# Altium project OctopusPB_r0102.PrjPcb (part 2 of 2)

## Sheet Power+USB.SchDoc
size A3
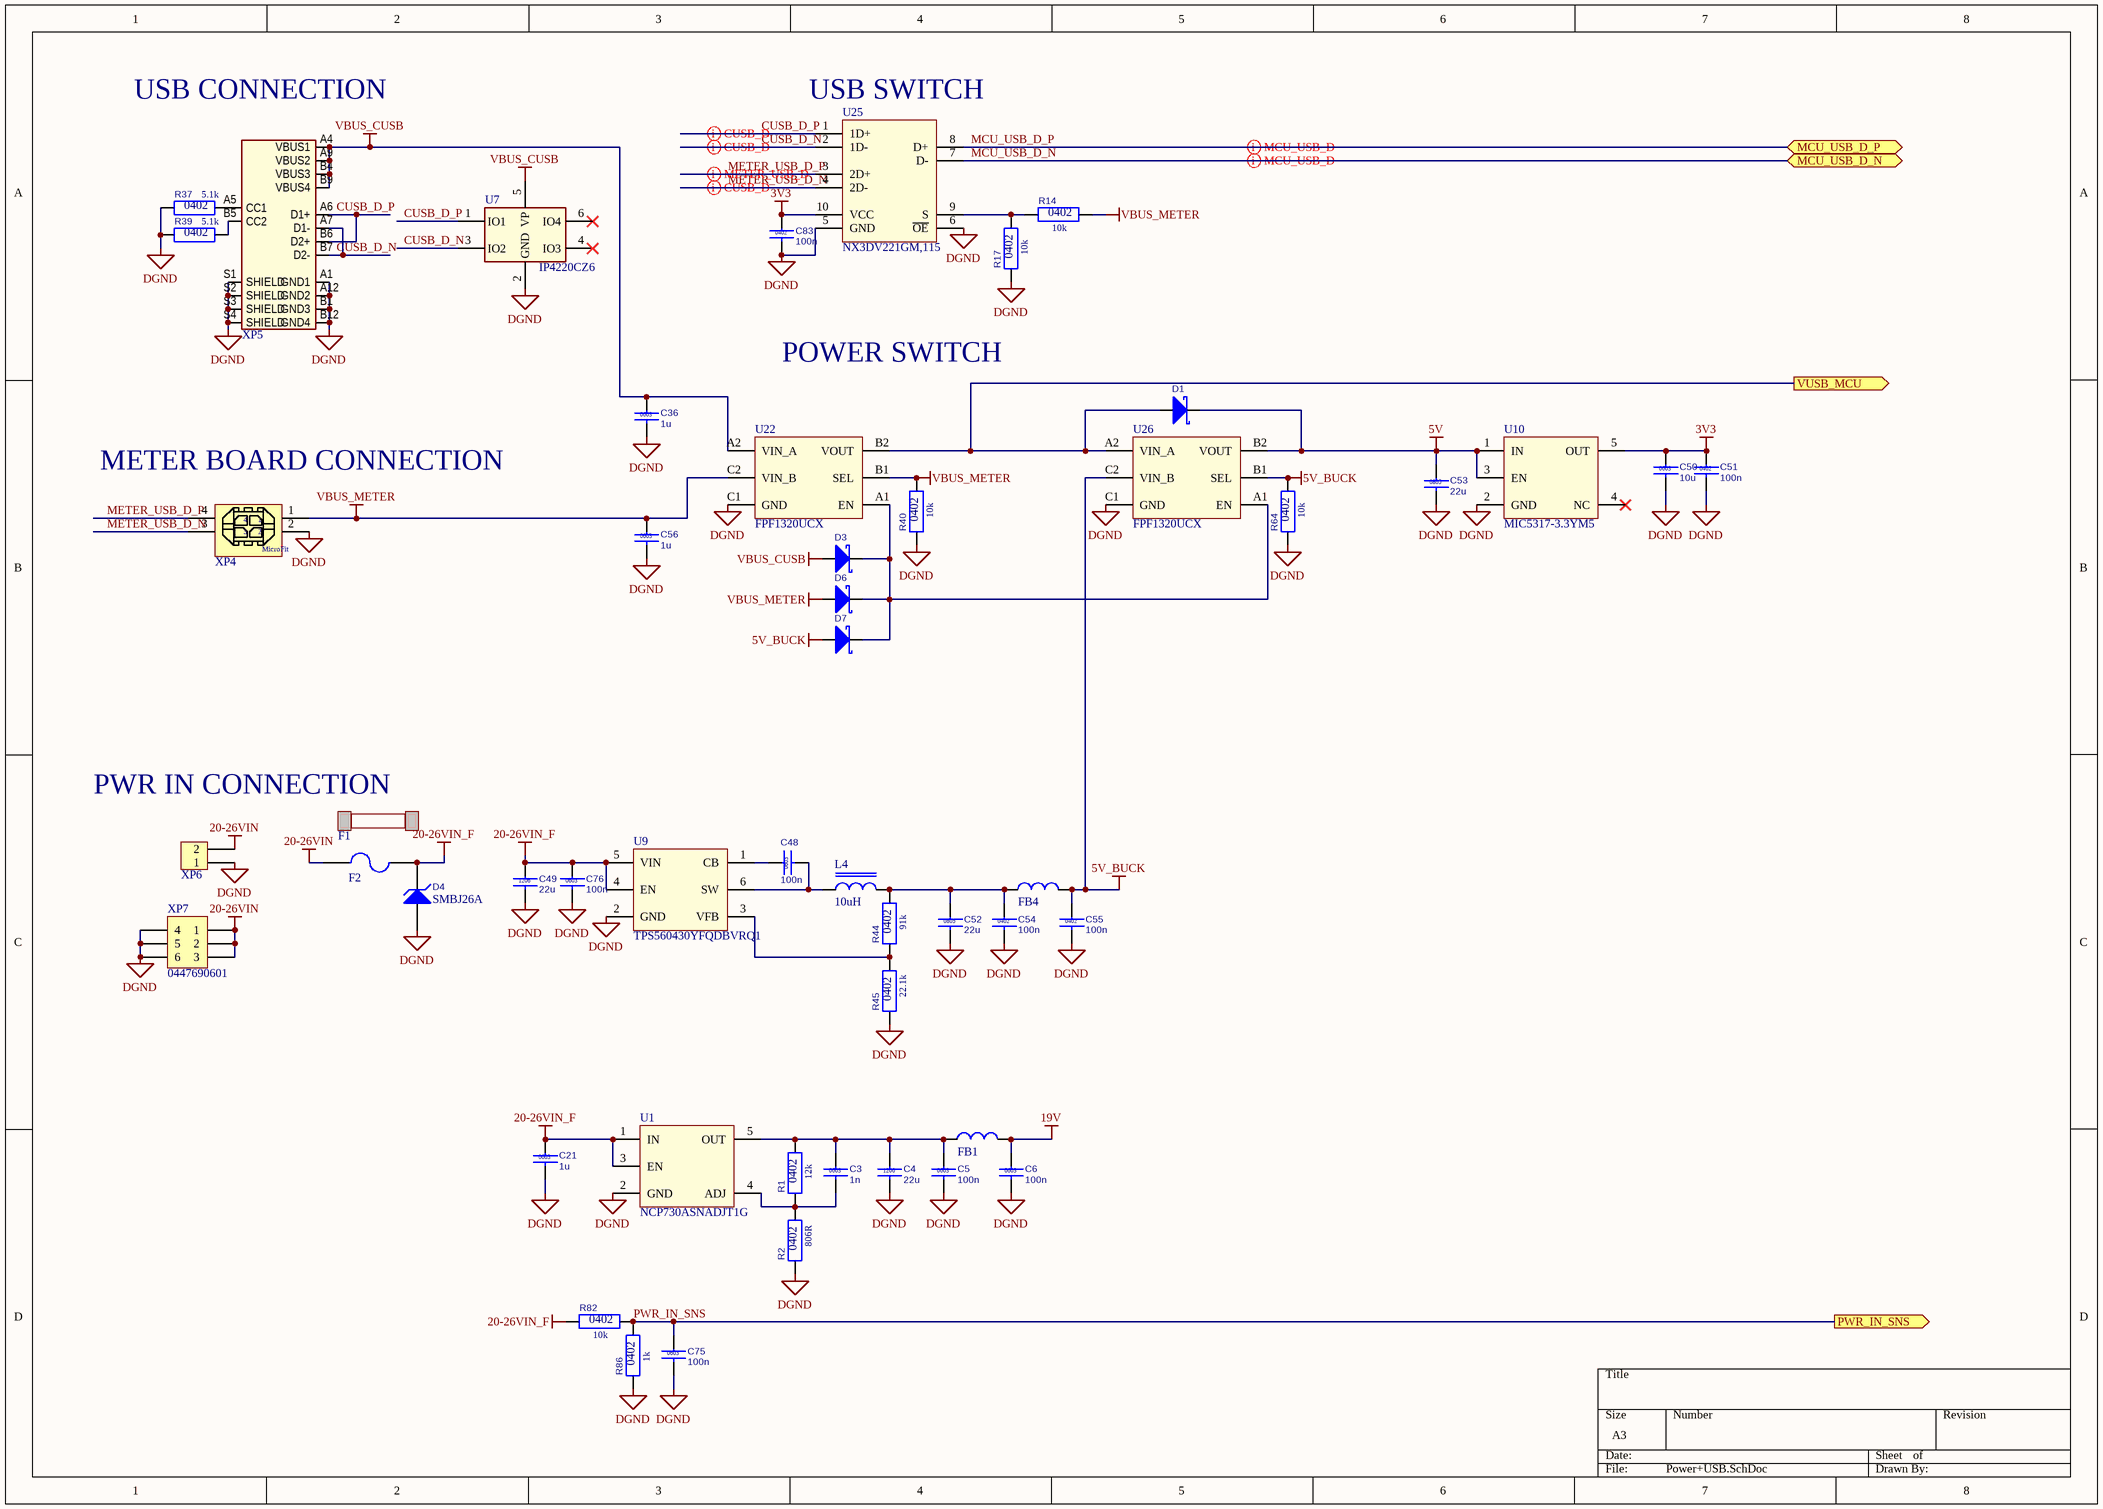
[diagram p5: Power+USB.SchDoc]

### Parts
C3  1n  Case: 0603  [CC0603M]
C4  22u  Case: 1206  [CC1206M]
C5  100n  Case: 0603  [CC0603M]
C6  100n  Case: 0603  [CC0603M]
C21  1u  Case: 0603  [CC0603M]
C36  1u  Case: 0603  [CC0603M]
C48  100n  Case: 0603  [CC0603M]
C49  22u  Case: 1206  [CC1206M]
C50  10u  Case: 0603  [CC0603M]
C51  100n  Case: 0402  [CC0402M]
C52  22u  Case: 0805  [CC0805M]
C53  22u  Case: 0805  [CC0805M]
C54  100n  Case: 0402  [CC0402M]
C55  100n  Case: 0402  [CC0402M]
C56  1u  Case: 0603  [CC0603M]
C75  100n  Case: 0603  [CC0603M]
C76  100n  Case: 0603  [CC0603M]
C83  100n  Case: 0402  [CC0402M]
D1  BAT54HT1G  [SOD323]  (value not drawn)
D3  BAT54HT1G  [SOD323]  (value not drawn)
D4  SMBJ26A  [SMB_UNI]
D6  BAT54HT1G  [SOD323]  (value not drawn)
D7  BAT54HT1G  [SOD323]  (value not drawn)
F1  0217015.MXP  (value not drawn)
F2  696108003002  [696108003002]  (value not drawn)
FB1  BLM18HG102SN1D  [FB0603M]  (value not drawn)
FB4  BLM21SP601SH1D  [FB0805M]  (value not drawn)
L4  10uH  [0518CDMCCDS]
R1  Case: 0402  [RC0402M]  (hidden comment: 12k)
R2  Case: 0402  [RC0402M]  (hidden comment: 806R)
R14  Case: 0402  [RC0402M]  (hidden comment: 10k)
R17  Case: 0402  [RC0402M]  (hidden comment: 10k)
R37  Case: 0402  [RC0402M]  (hidden comment: 5.1k)
R39  Case: 0402  [RC0402M]  (hidden comment: 5.1k)
R40  Case: 0402  [RC0402M]  (hidden comment: 10k)
R44  Case: 0402  [RC0402M]  (hidden comment: 91k)
R45  Case: 0402  [RC0402M]  (hidden comment: 22.1k)
R64  Case: 0402  [RC0402M]  (hidden comment: 10k)
R82  Case: 0402  [RC0402M]  (hidden comment: 10k)
R86  Case: 0402  [RC0402M]  (hidden comment: 1k)
U1  NCP730ASNADJT1G  [TSOP-5]
U7  IP4220CZ6  [TSOP-6]
U9  TPS560430YFQDBVRQ1  [SOT23-6]
U10  MIC5317-3.3YM5  [SOT23-5]
U22  FPF1320UCX  [WLCSP-6]
U25  NX3DV221GM,115  [XQFN-10(SOT1049-3)]
U26  FPF1320UCX  [WLCSP-6]
XP4  0447690401  [0447690401]  (value not drawn)
XP5  KUSBX-SL-CS1N14-B  [KUSBX-SL-CS1N14-B]  (value not drawn)
XP6  TBH-2x5.08P-RA-GN  [TBH-2x5.08P-RA-GN]  (value not drawn)
XP7  0447690601  [0447690601]

### Ports
MCU_USB_D_N (bidir), MCU_USB_D_P (bidir), PWR_IN_SNS (out), VUSB_MCU (out)

### Nets
3V3: C50.1 C51.1 C83.1 U10.5(OUT) U25.10(VCC)
5V: C53.1 D1.1(K) U10.1(IN) U10.3(EN) U26.B2(VOUT)
5V_BUCK: C55.1 D7.2(A) FB4.2 R64.2 U26.B1(SEL) U26.C2(VIN_B)
19V: C6.1 FB1.2
20-26VIN: F2.1 XP6.2 XP7.1 XP7.2 XP7.3
20-26VIN_F: C21.1 C49.1 C76.1 D4.1(K) F2.2 R82.1 U1.1(IN) U1.3(EN) U9.4(EN) U9.5(VIN)
DGND: C4.2 C5.2 C6.2 C21.2 C36.2 C49.2 C50.2 C51.2 C52.2 C53.2 C54.2 C55.2 C56.2 C75.2 C76.2 C83.2 D4.2(A) R2.1 R17.1 R37.1 R39.1 R40.1 R45.1 R64.1 R86.1 U1.2(GND) U7.2(GND) U9.2(GND) U10.2(GND) U22.C1(GND) U25.5(GND) U25.6(~{OE}) U26.C1(GND) XP4.2 XP5.A1(GND1) XP5.A12(GND2) XP5.B1(GND3) XP5.B12(GND4) XP5.S1(SHIELD) XP5.S2(SHIELD) XP5.S3(SHIELD) XP5.S4(SHIELD) XP6.1 XP7.4 XP7.5 XP7.6
VBUS_CUSB: C36.1 D3.2(A) U7.5(VP) U22.A2(VIN_A) XP5.A4(VBUS1) XP5.A9(VBUS2) XP5.B4(VBUS3) XP5.B9(VBUS4)
VBUS_METER: C56.1 D6.2(A) R14.2 R40.2 U22.B1(SEL) U22.C2(VIN_B) XP4.1
CUSB_D_N: U7.3(IO2) U25.2(1D-) XP5.A7(D1-) XP5.B7(D2-)
CUSB_D_P: U7.1(IO1) U25.1(1D+) XP5.A6(D1+) XP5.B6(D2+)
MCU_USB_D_N: U25.7(D-) ; port MCU_USB_D_N
MCU_USB_D_P: U25.8(D+) ; port MCU_USB_D_P
METER_USB_D_N: U25.4(2D-) XP4.3
METER_USB_D_P: U25.3(2D+) XP4.4
PWR_IN_SNS: C75.1 R82.2 R86.2 ; port PWR_IN_SNS
VUSB_MCU: D1.2(A) U22.B2(VOUT) U26.A2(VIN_A) ; port VUSB_MCU
NetC3_1: C3.1 C4.1 C5.1 FB1.1 R1.2 U1.5(OUT)
NetC3_2: C3.2 R1.1 R2.2 U1.4(ADJ)
NetC48_1: C48.1 U9.1(CB)
NetC48_2: C48.2 L4.1 U9.6(SW)
NetC52_1: C52.1 C54.1 FB4.1 L4.2 R44.2
NetD3_1: D3.1(K) D6.1(K) D7.1(K) U22.A1(EN) U26.A1(EN)
NetR14_1: R14.1 R17.2 U25.9(S)
NetR37_2: R37.2 XP5.A5(CC1)
NetR39_2: R39.2 XP5.B5(CC2)
NetR44_1: R44.1 R45.2 U9.3(VFB)

Not connected (* = marked no-connect by the designer): U7 4(IO3)* 6(IO4)*; U10 4(NC)*

### Layout directives
differential pair: CUSB_D_N, CUSB_D_P, MCU_USB_D_N, MCU_USB_D_P, METER_USB_D_N, METER_USB_D_P

### Notes on the sheet
- (near XP5) USB CONNECTION
- (near U25) USB SWITCH
- POWER SWITCH
- (near XP4) METER BOARD CONNECTION
- (near F1) PWR IN CONNECTION
- (in symbol 0447690401) MicroFit

### Library data of the parts
C3 = CC0603K-X7R-50V-1N-M: Chip ceramic capacitor; Manufacturer PN: CC0603KRX7R9BB102; Manufacturer: Yageo; Tollerance: 10%; Rated Voltage: 50V; Material: X7R; PartNumber: CC0603K-X7R-50V-1N-M; Value: 1n; Publisher: alexey.savchenko; Publishing Date: 1/12/2020
C4 C49 = CC1206K-X5R-35V-22U-M: Chip ceramic capacitor; Manufacturer PN: C3216X5R1V226M160AC; Manufacturer: TDK; Tollerance: 10%; Rated Voltage: 35V; Material: X5R; PartNumber: CC1206K-X5R-35V-22U-M; Value: 22u; Publisher: alexey.savchenko; Publishing Date: 3/30/2020
C5 C6 C48 C75 C76 = CC0603K-X7R-50V-100N-M: Chip ceramic capacitor; Manufacturer PN: CC0603KRX7R9BB104; Manufacturer: Yageo; Tollerance: 10%; Rated Voltage: 50V; Material: X7R; PartNumber: CC0603K-X7R-50V-100N-M; Value: 100n; Publisher: alexey.savchenko; Publishing Date: 1/12/2020
C21 = CC0603K-X5R-50V-1U-M: Chip ceramic capacitor; Manufacturer PN: CL10A105KB8NNNC; Manufacturer: Samsung; Tollerance: 10%; Rated Voltage: 50V; Material: X5R; PartNumber: CC0603K-X5R-50V-1U-M; Value: 1u; Publisher: alexey.savchenko; Publishing Date: 1/12/2020
C36 C56 = CC0603K-X7R-10V-1U-M: Chip ceramic capacitor; Manufacturer PN: CL10B105KP8NNNC; Manufacturer: Samsung; Tollerance: 10%; Rated Voltage: 10V; Material: X5R; PartNumber: CC0603K-X7R-10V-1U-M; Value: 1u; Publisher: alexey.savchenko; Publishing Date: 1/12/2020
C50 = CC0603K-X5R-10V-10U-M: Chip ceramic capacitor; Manufacturer PN: GRM188R61A106KE69D; Manufacturer: Murata; Tollerance: 10%; Rated Voltage: 10V; Material: X5R; PartNumber: CC0603K-X5R-10V-10U-M; Value: 10u; Publisher: alexey.savchenko; Publishing Date: 1/12/2020
C51 C54 C55 C83 = CC0402K-X7R-25V-100N-M: Chip ceramic capacitor; Manufacturer PN: GRM155R71E104KE14J; Manufacturer: Murata; Tollerance: 10%; Rated Voltage: 25V; Material: X7R; PartNumber: CC0402K-X7R-25V-100N-M; Value: 100n; Publisher: alexey.savchenko; Publishing Date: 1/12/2020
C52 C53 = CC0805K-X5R-10V-22U-M: Chip ceramic capacitor; Manufacturer PN: CL21A226KPCLRNC; Manufacturer: Samsung; Tollerance: 10%; Rated Voltage: 10V; Material: X5R; PartNumber: CC0805K-X5R-10V-22U-M; Value: 22u; Publisher: alexey.savchenko; Publishing Date: 2/17/2020
D1 D3 D6 D7 = BAT54HT1G: DIODE SCHOTTKY 30V 200MA SOD323; Manufacturer: ON Semiconductor; PartNumber: BAT54HT1G; Manufacturer PN: BAT54HT1G; Case: SOD323; Publisher: alexey.savchenko; Publishing Date: 2/17/2020
D4 = SMBJ26A: TVS DIODE Unidirectional 26V DO214AA; Manufacturer: Littelfuse Inc.; PartNumber: SMBJ26A; Manufacturer PN: SMBJ26A; Case: SMB_UNI; Publisher: alexey.savchenko; Publishing Date: 2/14/2020
F1 = 0217015.MXP: 15A 250V AC DC Fuse Cartridge, Glass Holder 5mm x 20mm; Manufacturer: Littlefuse; PartNumber: 0217015.MXP; Manufacturer PN: 0217015.MXP; Publisher: alexey.savchenko; Publishing Date: 2/14/2020
F2 = 696108003002: FUSEHOLDER BLOCKS - PCB - CLIP C; Manufacturer: Würth Elektronik; PartNumber: 696108003002; Manufacturer PN: 696108003002; Publisher: alexey.savchenko; Publishing Date: 2/14/2020
FB1 = BLM18HG102SN1D: FERRITE BEAD 1 KOHM 0603 1LN; Manufacturer: Murata; Resistance: 1000; PartNumber: BLM18HG102SN1D; Manufacturer PN: BLM18HG102SN1D; Publisher: alexey.savchenko; Publishing Date: 1/12/2020
FB4 = BLM21SP601SH1D: 600 Ohms @ 100MHz 1 Power Line Ferrite Bead 0805 (2012 Metric) 2.3A; Manufacturer: Murata; Resistance: 600; PartNumber: BLM21SP601SH1D; Manufacturer PN: BLM21SP601SH1D; Publisher: alexey.savchenko; Publishing Date: 2/17/2020
L4 = 0518CDMCCDS-100MC: 10µH Shielded Molded Inductor 2.3A 155mOhm Max Nonstandard; Manufacturer: Sumida; Tollerance: 20%; PartNumber: 0518CDMCCDS-100MC; Manufacturer PN: 0518CDMCCDS-100MC; Value: 10uH; Publisher: alexey.savchenko; Publishing Date: 4/1/2020
R1 = RC0402F-12K-M: Chip resistor; Manufacturer PN: RC0402FR-0712KL; Manufacturer: Yageo; Tollerance: 1%; Rated Voltage: 50V; Power: 0.063W; T Coefficient: 100ppm; Value: 12k; PartNumber: RC0402F-12K-M; Publisher: alexey.savchenko; Publishing Date: 2/24/2020
R2 = RC0402F-806R-M: Chip resistor; Manufacturer PN: RC0402FR-07806RL; Manufacturer: Yageo; Tollerance: 1%; Rated Voltage: 50V; Power: 0.063W; T Coefficient: 100ppm; Value: 806R; PartNumber: RC0402F-806R-M; Publisher: alexey.savchenko; Publishing Date: 2/24/2020
R14 R17 R40 R64 R82 = RC0402F-10K-M: Chip resistor; Manufacturer PN: RC0402FR-0710KL; Manufacturer: Yageo; Tollerance: 1%; Rated Voltage: 50V; Power: 0.063W; T Coefficient: 100ppm; Value: 10k; PartNumber: RC0402F-10K-M; Publisher: alexey.savchenko; Publishing Date: 2/24/2020
R37 R39 = RC0402F-5K1-M: Chip resistor; Manufacturer PN: RC0402FR-075K1L; Manufacturer: Yageo; Tollerance: 1%; Rated Voltage: 50V; Power: 0.063W; T Coefficient: 100ppm; Value: 5.1k; PartNumber: RC0402F-5K1-M; Publisher: alexey.savchenko; Publishing Date: 2/24/2020
R44 = RC0402F-91K-M: Chip resistor; Manufacturer PN: RC0402FR-0791KL; Manufacturer: Yageo; Tollerance: 1%; Rated Voltage: 50V; Power: 0.063W; T Coefficient: 100ppm; Value: 91k; PartNumber: RC0402F-91K-M; Publisher: alexey.savchenko; Publishing Date: 2/24/2020
R45 = RC0402F-22K1-M: Chip resistor; Manufacturer PN: RC0402FR-0722K1L; Manufacturer: Yageo; Tollerance: 1%; Rated Voltage: 50V; Power: 0.063W; T Coefficient: 100ppm; Value: 22.1k; PartNumber: RC0402F-22K1-M; Publisher: alexey.savchenko; Publishing Date: 2/24/2020
R86 = RC0402F-1K-M: Chip resistor; Manufacturer PN: RC0402FR-071KL; Manufacturer: Yageo; Tollerance: 1%; Rated Voltage: 50V; Power: 0.063W; T Coefficient: 100ppm; Value: 1k; PartNumber: RC0402F-1K-M; Publisher: alexey.savchenko; Publishing Date: 2/24/2020
U1 = NCP730ASNADJT1G: NCP730 TSOP-5 ADJ; Manufacturer: ON Semiconductor; PartNumber: NCP730ASNADJT1G; Manufacturer PN: NCP730ASNADJT1G; Case: TSOP-5; Publisher: alexey.savchenko; Publishing Date: 12/10/2020
U7 = IP4220CZ6: TVS DIODE 5.5V 6TSOP; Manufacturer: Nexperia; PartNumber: IP4220CZ6; Manufacturer PN: IP4220CZ6; Case: TSOP-6; Publisher: alexey.savchenko; Publishing Date: 1/24/2020
U9 = TPS560430YFQDBVRQ1: Buck Switching Regulator IC Positive Adjustable 1V 1 Output 600mA SOT-23-6; Manufacturer: TI; PartNumber: TPS560430YFQDBVRQ1; Manufacturer PN: TPS560430YFQDBVRQ1; Case: SOT23-6; Publisher: alexey.savchenko; Publishing Date: 3/31/2020
U10 = MIC5317-3.3YM5: Linear Voltage Regulator IC 1 Output 150mA SOT-23-5; Manufacturer: Microchip; PartNumber: MIC5317-3.3YM5; Manufacturer PN: MIC5317-3.3YM5; Case: SOT23-5; Publisher: alexey.savchenko; Publishing Date: 3/10/2020
U22 U26 = FPF1320UCX: Power Switch/Driver 2:1 P-Channel 1.5A 6-WLCSP (0.96x1.66); Manufacturer: ON Semiconductor; PartNumber: FPF1320UCX; Manufacturer PN: FPF1320UCX; Case: WLCSP-6; Publisher: alexey.savchenko; Publishing Date: 4/10/2020
U25 = NX3DV221GM,115: IC USB 2.0 SWITCH HS 10XQFN; Manufacturer: NXP; Analogs: PI3USB221AZUAEX; PartNumber: NX3DV221GM,115; Manufacturer PN: NX3DV221GM,115; Case: XQFN-10(SOT1049-3); Publisher: alexey.savchenko; Publishing Date: 4/9/2020
XP4 = 0447690401: Micro-Fit BMI Receptacle Header, Dual Row, Vertical, with Press-fit Plastic Pegs, 2.54µm Tin (Sn), 4 Circuits; Manufacturer: Molex; Analogs: 0447690402, 0447690403; PartNumber: 0447690401; Manufacturer PN: 0447690401; Publisher: alexey.savchenko; Publishing Date: 2/14/2020
XP5 = KUSBX-SL-CS1N14-B: CONN USB TYPE-C TH UPRIGHT FLAG; Manufacturer: Kycon; PartNumber: KUSBX-SL-CS1N14-B; Manufacturer PN: KUSBX-SL-CS1N14-B; Publisher: alexey.savchenko; Publishing Date: 4/17/2020
XP6 = TBH-2x5.08P-RA-GN: TERM BLOCK HDR 2POS 90DEG 5.08MM, Green; Manufacturer PN: +1757019(Plug); Manufacturer: Phoenix Contact; PartNumber: TBH-2x5.08P-RA-GN; Publisher: alexey.savchenko; Publishing Date: 2/14/2020
XP7 = 0447690601: Micro-Fit BMI Receptacle Header, Dual Row, Vertical, with Press-fit Plastic Pegs, 2.54µm Tin (Sn), 6 Circuits; Manufacturer: Molex; Analogs: 0447690602, 0447690603; PartNumber: 0447690601; Manufacturer PN: 0447690601; Publisher: alexey.savchenko; Publishing Date: 4/29/2020

## Nets that join several sheets
3V3: Control (25 pins), Expanders (28 pins), Designator/B1 (13 pins), Designator/B2 (13 pins), Designator/B3 (13 pins), Designator/B4 (13 pins), Designator/B5 (13 pins), Designator/B6 (13 pins), Designator/B7 (13 pins), Designator/B8 (13 pins), Power+USB (5 pins)
3V3A: Control (5 pins), Designator/F1 (C24_F1.2 U14_F1.4), Designator/F2 (C24_F2.2 U14_F2.4)
5V_BUCK: Control (C73.1 Q5.2 R71.1), Power+USB (6 pins)
19V: Designator/B1 (C12_B1.1 U3_B1.5), Designator/B2 (C12_B2.1 U3_B2.5), Designator/B3 (C12_B3.1 U3_B3.5), Designator/B4 (C12_B4.1 U3_B4.5), Designator/B5 (C12_B5.1 U3_B5.5), Designator/B6 (C12_B6.1 U3_B6.5), Designator/B7 (C12_B7.1 U3_B7.5), Designator/B8 (C12_B8.1 U3_B8.5), Power+USB (C6.1 FB1.2)
20-26VIN_F: Designator/B1 (5 pins), Designator/B2 (5 pins), Designator/B3 (5 pins), Designator/B4 (5 pins), Designator/B5 (5 pins), Designator/B6 (5 pins), Designator/B7 (5 pins), Designator/B8 (5 pins), Power+USB (10 pins)
AGND: Control (10 pins), Designator/F1 (14 pins), Designator/F2 (14 pins)
DGND: Control (25 pins), Expanders (23 pins), Designator/B1 (59 pins), Designator/B2 (59 pins), Designator/B3 (59 pins), Designator/B4 (59 pins), Designator/B5 (59 pins), Designator/B6 (59 pins), Designator/B7 (59 pins), Designator/B8 (59 pins), Power+USB (46 pins)
EARTH: Control (7 pins), Designator/B1 (MH1_B1.0 MH4_B1.0), Designator/B2 (MH1_B2.0 MH4_B2.0), Designator/B3 (MH1_B3.0 MH4_B3.0), Designator/B4 (MH1_B4.0 MH4_B4.0), Designator/B5 (MH1_B5.0 MH4_B5.0), Designator/B6 (MH1_B6.0 MH4_B6.0), Designator/B7 (MH1_B7.0 MH4_B7.0), Designator/B8 (MH1_B8.0 MH4_B8.0)
BUCK_CTRL_A1: Expanders (U11.7), Designator/B1 (U2_B1.11)
BUCK_CTRL_A2: Expanders (U11.2), Designator/B2 (U2_B2.11)
BUCK_CTRL_A3: Expanders (U13.7), Designator/B3 (U2_B3.11)
BUCK_CTRL_A4: Expanders (U13.2), Designator/B4 (U2_B4.11)
BUCK_CTRL_A5: Expanders (U16.7), Designator/B5 (U2_B5.11)
BUCK_CTRL_A6: Expanders (U16.2), Designator/B6 (U2_B6.11)
BUCK_CTRL_A7: Expanders (U18.7), Designator/B7 (U2_B7.11)
BUCK_CTRL_A8: Expanders (U18.2), Designator/B8 (U2_B8.11)
BUCK_CTRL_B1: Expanders (U11.8), Designator/B1 (U2_B1.10)
BUCK_CTRL_B2: Expanders (U11.3), Designator/B2 (U2_B2.10)
BUCK_CTRL_B3: Expanders (U13.8), Designator/B3 (U2_B3.10)
BUCK_CTRL_B4: Expanders (U13.3), Designator/B4 (U2_B4.10)
BUCK_CTRL_B5: Expanders (U16.8), Designator/B5 (U2_B5.10)
BUCK_CTRL_B6: Expanders (U16.3), Designator/B6 (U2_B6.10)
BUCK_CTRL_B7: Expanders (U18.8), Designator/B7 (U2_B7.10)
BUCK_CTRL_B8: Expanders (U18.3), Designator/B8 (U2_B8.10)
BUCK_CTRL_C1: Expanders (U11.9), Designator/B1 (U2_B1.9)
BUCK_CTRL_C2: Expanders (U11.4), Designator/B2 (U2_B2.9)
BUCK_CTRL_C3: Expanders (U13.9), Designator/B3 (U2_B3.9)
BUCK_CTRL_C4: Expanders (U13.4), Designator/B4 (U2_B4.9)
BUCK_CTRL_C5: Expanders (U16.9), Designator/B5 (U2_B5.9)
BUCK_CTRL_C6: Expanders (U16.4), Designator/B6 (U2_B6.9)
BUCK_CTRL_C7: Expanders (U18.9), Designator/B7 (U2_B7.9)
BUCK_CTRL_C8: Expanders (U18.4), Designator/B8 (U2_B8.9)
CLK_1MHz: Expanders (R52.2), Designator/B1 (U2_B1.15), Designator/B2 (U2_B2.15), Designator/B3 (U2_B3.15), Designator/B4 (U2_B4.15), Designator/B5 (U2_B5.15), Designator/B6 (U2_B6.15), Designator/B7 (U2_B7.15), Designator/B8 (U2_B8.15)
CLK_2MHz: Expanders (R12.2), Designator/B1 (U2_B1.12), Designator/B2 (U2_B2.12), Designator/B3 (U2_B3.12), Designator/B4 (U2_B4.12), Designator/B5 (U2_B5.12), Designator/B6 (U2_B6.12), Designator/B7 (U2_B7.12), Designator/B8 (U2_B8.12)
CLK_250kHz: Expanders (R13.2), Designator/B1 (U2_B1.13), Designator/B2 (U2_B2.13), Designator/B3 (U2_B3.13), Designator/B4 (U2_B4.13), Designator/B5 (U2_B5.13), Designator/B6 (U2_B6.13), Designator/B7 (U2_B7.13), Designator/B8 (U2_B8.13)
CLK_500kHz: Expanders (R55.2), Designator/B1 (U2_B1.14), Designator/B2 (U2_B2.14), Designator/B3 (U2_B3.14), Designator/B4 (U2_B4.14), Designator/B5 (U2_B5.14), Designator/B6 (U2_B6.14), Designator/B7 (U2_B7.14), Designator/B8 (U2_B8.14)
CLK_EN: Control (U5.51), Expanders (R54.2 U15.1)
DANGER_OV_SNS1: Expanders (U11.10), Designator/B1 (R7_B1.1 U2_B1.6 U21_B1.1)
DANGER_OV_SNS2: Expanders (U11.5), Designator/B2 (R7_B2.1 U2_B2.6 U21_B2.1)
DANGER_OV_SNS3: Expanders (U13.10), Designator/B3 (R7_B3.1 U2_B3.6 U21_B3.1)
DANGER_OV_SNS4: Expanders (U13.5), Designator/B4 (R7_B4.1 U2_B4.6 U21_B4.1)
DANGER_OV_SNS5: Expanders (U16.10), Designator/B5 (R7_B5.1 U2_B5.6 U21_B5.1)
DANGER_OV_SNS6: Expanders (U16.5), Designator/B6 (R7_B6.1 U2_B6.6 U21_B6.1)
DANGER_OV_SNS7: Expanders (U18.10), Designator/B7 (R7_B7.1 U2_B7.6 U21_B7.1)
DANGER_OV_SNS8: Expanders (U18.5), Designator/B8 (R7_B8.1 U2_B8.6 U21_B8.1)
I2C0_SCL: Expanders (R46.1 U11.12 U12.5 U13.12), Designator/B1 (R23_B1.2 U4_B1.5 U20_B1.6), Designator/B2 (R23_B2.2 U4_B2.5 U20_B2.6), Designator/B3 (R23_B3.2 U4_B3.5 U20_B3.6), Designator/B4 (R23_B4.2 U4_B4.5 U20_B4.6)
I2C0_SDA: Expanders (R47.1 U11.13 U12.4 U13.13), Designator/B1 (R24_B1.2 U4_B1.7 U20_B1.5), Designator/B2 (R24_B2.2 U4_B2.7 U20_B2.5), Designator/B3 (R24_B3.2 U4_B3.7 U20_B3.5), Designator/B4 (R24_B4.2 U4_B4.7 U20_B4.5)
I2C1_SCL: Expanders (R48.1 U12.8 U16.12 U18.12), Designator/B5 (R23_B5.2 U4_B5.5 U20_B5.6), Designator/B6 (R23_B6.2 U4_B6.5 U20_B6.6), Designator/B7 (R23_B7.2 U4_B7.5 U20_B7.6), Designator/B8 (R23_B8.2 U4_B8.5 U20_B8.6)
I2C1_SDA: Expanders (R49.1 U12.7 U16.13 U18.13), Designator/B5 (R24_B5.2 U4_B5.7 U20_B5.5), Designator/B6 (R24_B6.2 U4_B6.7 U20_B6.5), Designator/B7 (R24_B7.2 U4_B7.7 U20_B7.5), Designator/B8 (R24_B8.2 U4_B8.7 U20_B8.5)
MCU_USB_D_N: Control (R41.2), Power+USB (U25.7)
MCU_USB_D_P: Control (R38.2), Power+USB (U25.8)
PGND_ADC1: Designator/B1 (X1_B1.2), Designator/F1 (R53_F1.2)
PGND_ADC2: Designator/B2 (X1_B2.2), Designator/F1 (R61_F1.2)
PGND_ADC3: Designator/B3 (X1_B3.2), Designator/F1 (R60_F1.2)
PGND_ADC4: Designator/B4 (X1_B4.2), Designator/F1 (R16_F1.2)
PGND_ADC5: Designator/B5 (X1_B5.2), Designator/F2 (R61_F2.2)
PGND_ADC6: Designator/B6 (X1_B6.2), Designator/F2 (R53_F2.2)
PGND_ADC7: Designator/B7 (X1_B7.2), Designator/F2 (R60_F2.2)
PGND_ADC8: Designator/B8 (X1_B8.2), Designator/F2 (R16_F2.2)
PWR_IN_SNS: Control (U5.11), Power+USB (C75.1 R82.2 R86.2)
SCL_INT: Control (U5.1), Expanders (R50.1 U12.1)
SDA_INT: Control (U5.2), Expanders (R51.1 U12.2)
VOUT_CH1: Control (U5.28), Designator/F1 (C25_F1.2 C78_F1.1 R18_F1.1 U14_F1.1)
VOUT_CH2: Control (U5.27), Designator/F1 (C82_F1.2 C87_F1.1 R56_F1.1 U14_F1.14)
VOUT_CH3: Control (U5.19), Designator/F1 (C81_F1.2 C86_F1.1 R35_F1.1 U14_F1.7)
VOUT_CH4: Control (U5.18), Designator/F1 (C67_F1.2 C79_F1.1 R15_F1.1 U14_F1.8)
VOUT_CH5: Control (U5.17), Designator/F2 (C82_F2.2 C87_F2.1 R56_F2.1 U14_F2.14)
VOUT_CH6: Control (U5.16), Designator/F2 (C25_F2.2 C78_F2.1 R18_F2.1 U14_F2.1)
VOUT_CH7: Control (U5.14), Designator/F2 (C81_F2.2 C86_F2.1 R35_F2.1 U14_F2.7)
VOUT_CH8: Control (U5.12), Designator/F2 (C67_F2.2 C79_F2.1 R15_F2.1 U14_F2.8)
VOUT_SH_BUF1: Designator/B1 (R1_B1.2 R2_B1.2 U3_B1.1 U3_B1.4), Designator/F1 (R57_F1.2)
VOUT_SH_BUF2: Designator/B2 (R1_B2.2 R2_B2.2 U3_B2.1 U3_B2.4), Designator/F1 (R63_F1.2)
VOUT_SH_BUF3: Designator/B3 (R1_B3.2 R2_B3.2 U3_B3.1 U3_B3.4), Designator/F1 (R62_F1.2)
VOUT_SH_BUF4: Designator/B4 (R1_B4.2 R2_B4.2 U3_B4.1 U3_B4.4), Designator/F1 (R19_F1.2)
VOUT_SH_BUF5: Designator/B5 (R1_B5.2 R2_B5.2 U3_B5.1 U3_B5.4), Designator/F2 (R63_F2.2)
VOUT_SH_BUF6: Designator/B6 (R1_B6.2 R2_B6.2 U3_B6.1 U3_B6.4), Designator/F2 (R57_F2.2)
VOUT_SH_BUF7: Designator/B7 (R1_B7.2 R2_B7.2 U3_B7.1 U3_B7.4), Designator/F2 (R62_F2.2)
VOUT_SH_BUF8: Designator/B8 (R1_B8.2 R2_B8.2 U3_B8.1 U3_B8.4), Designator/F2 (R19_F2.2)
VUSB_MCU: Control (R30.2), Power+USB (D1.2 U22.B2 U26.A2)

## Assembly variants
Octopus: not fitted C4_B1 C4_B2 C4_B3 C4_B4 C4_B5 C4_B6 C4_B7 C4_B8 FB2_B1 FB2_B2 FB2_B3 FB2_B4 FB2_B5 FB2_B6 FB2_B7 FB2_B8 R6_B1 R6_B2 R6_B3 R6_B4 R6_B5 R6_B6 R6_B7 R6_B8 R7_B1 R7_B2 R7_B3 R7_B4 R7_B5 R7_B6 R7_B7 R7_B8 R8_B1 R8_B3 R8_B5 R8_B7 R23_B1 R23_B2 R23_B3 R23_B5 R23_B6 R23_B7 R24_B1 R24_B2 R24_B4 R24_B5 R24_B6 R24_B8 R25_B1 R25_B3 R25_B4 R25_B5 R25_B7 R25_B8 R26_B2 R26_B3 R26_B4 R26_B6 R26_B7 R26_B8 R58_B2 R58_B4 R58_B6 R58_B8 R59_B1 R59_B2 R59_B5 R59_B6 R69 R74_B3 R74_B4 R74_B7 R74_B8 XP6
PB_alone: not fitted C4_B1 C4_B2 C4_B3 C4_B4 C4_B5 C4_B6 C4_B7 C4_B8 R6_B1 R6_B2 R6_B3 R6_B4 R6_B5 R6_B6 R6_B7 R6_B8 R7_B1 R7_B2 R7_B3 R7_B4 R7_B5 R7_B6 R7_B7 R7_B8 R8_B1 R8_B3 R8_B5 R8_B7 R23_B1 R23_B2 R23_B3 R23_B5 R23_B6 R23_B7 R24_B1 R24_B2 R24_B4 R24_B5 R24_B6 R24_B8 R25_B1 R25_B3 R25_B4 R25_B5 R25_B7 R25_B8 R26_B2 R26_B3 R26_B4 R26_B6 R26_B7 R26_B8 R58_B2 R58_B4 R58_B6 R58_B8 R59_B1 R59_B2 R59_B5 R59_B6 R69 R74_B3 R74_B4 R74_B7 R74_B8 XP6; alternate parts C2_B1 -> CC0402K-X7R-50V-22N-M, C2_B2 -> CC0402K-X7R-50V-22N-M, C2_B3 -> CC0402K-X7R-50V-22N-M, C2_B4 -> CC0402K-X7R-50V-22N-M, C2_B5 -> CC0402K-X7R-50V-22N-M, C2_B6 -> CC0402K-X7R-50V-22N-M, C2_B7 -> CC0402K-X7R-50V-22N-M, C2_B8 -> CC0402K-X7R-50V-22N-M